# EAGLE design Maze Schematic (EAGLE 9.0.0)
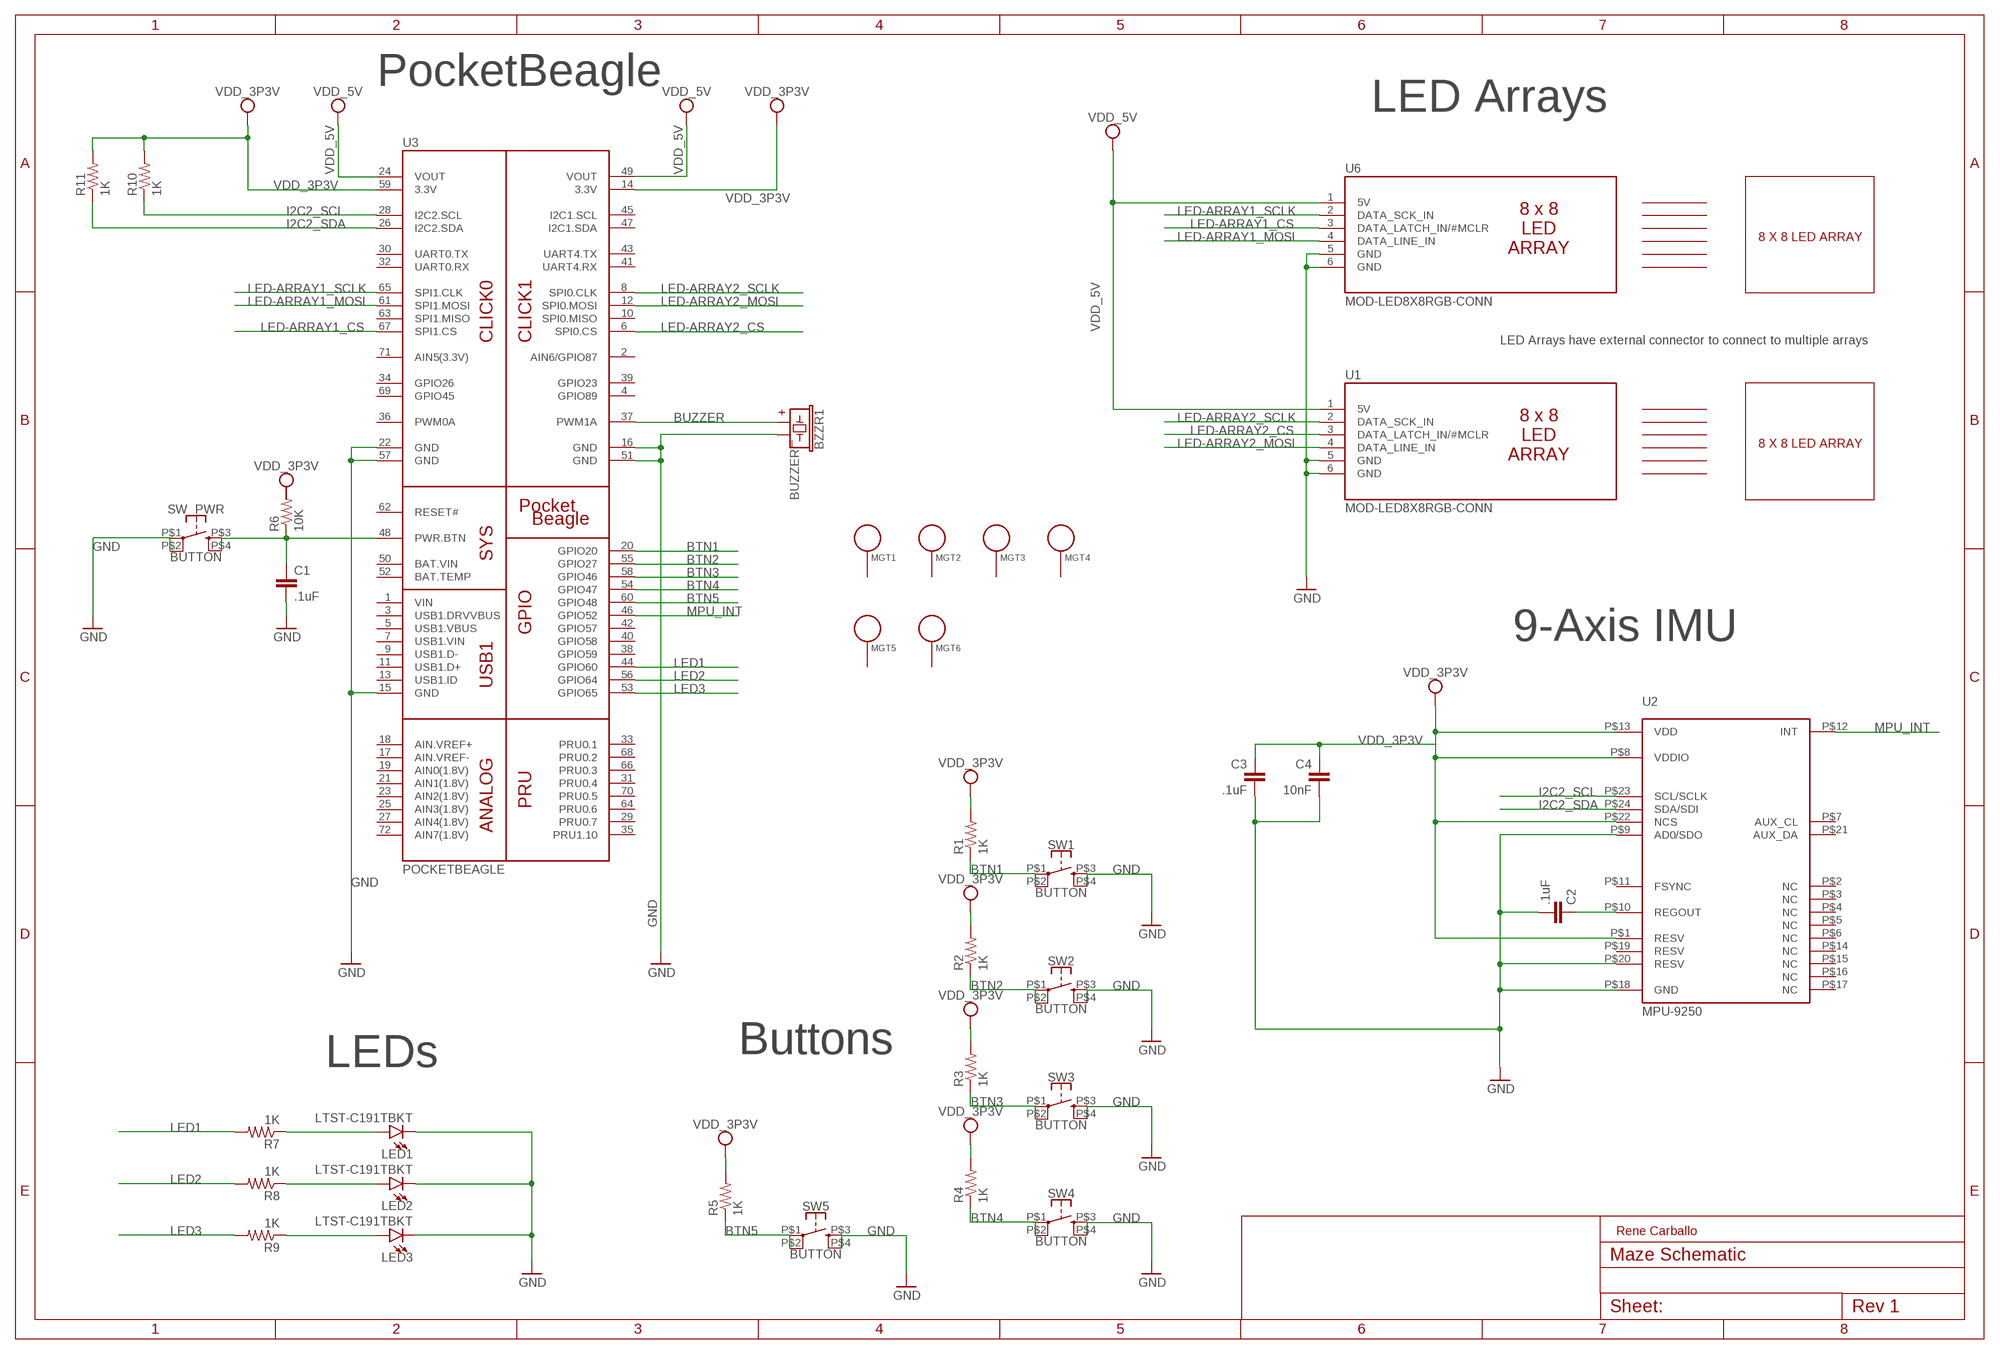
[diagram p0: schematic, sheet 1]

## Parts
BZZR1  BUZZER  [BUZZER-12MM]
C1  .1uF  C_C0603  [C0603]
C2  .1uF  C_C0603  [C0603]
C3  .1uF  C_C0603  [C0603]
C4  10nF  C_C0603  [C0603]
LED1  LTST-C191TBKT  [LED-SMD]
LED2  LTST-C191TBKT  [LED-SMD]
LED3  LTST-C191TBKT  [LED-SMD]
MGT1  MOUNTING_HOLE  [MOUNTING_HOLE]
MGT2  MOUNTING_HOLE  [MOUNTING_HOLE]
MGT3  MOUNTING_HOLE  [MOUNTING_HOLE]
MGT4  MOUNTING_HOLE  [MOUNTING_HOLE]
MGT5  MOUNTING_HOLE  [MOUNTING_HOLE]
MGT6  MOUNTING_HOLE  [MOUNTING_HOLE]
R1  1K  R_R0603  [R0603]
R2  1K  R_R0603  [R0603]
R3  1K  R_R0603  [R0603]
R4  1K  R_R0603  [R0603]
R5  1K  R_R0603  [R0603]
R6  10K  R_R0603  [R0603]
R7  1K  R_R0603  [R0603]
R8  1K  R_R0603  [R0603]
R9  1K  R_R0603  [R0603]
R10  1K  R_R0603  [R0603]
R11  1K  R_R0603  [R0603]
SW1  BUTTON  [BUTTON-11.5X11.7MM]
SW2  BUTTON  [BUTTON-11.5X11.7MM]
SW3  BUTTON  [BUTTON-11.5X11.7MM]
SW4  BUTTON  [BUTTON-11.5X11.7MM]
SW5  BUTTON  [BUTTON-11.5X11.7MM]
SW_PWR  BUTTON  [BUTTON-11.5X11.7MM]
U1  MOD-LED8X8RGB-CONN  [FE06W]
U2  MPU-9250  [QFN-3X3MM]
U3  POCKETBEAGLE  [POCKETBEAGLE]
U6  MOD-LED8X8RGB-CONN  [FE06W]

## Nets
BTN1: R1.1 SW1.P$1 SW1.P$2 U3.20(GPIO20)
BTN2: R2.1 SW2.P$1 SW2.P$2 U3.55(GPIO27)
BTN3: R3.1 SW3.P$1 SW3.P$2 U3.58(GPIO46)
BTN4: R4.1 SW4.P$1 SW4.P$2 U3.54(GPIO47)
BTN5: R5.1 SW5.P$1 SW5.P$2 U3.60(GPIO48)
BUZZER: BZZR1.+ U3.37(PWM1A)
GND: BZZR1.- C1.2 C2.2 C3.2 C4.2 LED1.C(-) LED2.C(-) LED3.C(-) SW1.P$3 SW1.P$4 SW2.P$3 SW2.P$4 SW3.P$3 SW3.P$4 SW4.P$3 SW4.P$4 SW5.P$3 SW5.P$4 SW_PWR.P$1 SW_PWR.P$2 U1.5(GND) U1.6(GND) U2.P$9(AD0/SDO) U2.P$18(GND) U2.P$20(RESV) U3.15(GND) U3.16(GND) U3.22(GND) U3.51(GND) U3.57(GND) U6.5(GND) U6.6(GND)
I2C2_SCL: R10.1 U2.P$23(SCL/SCLK) U3.28(I2C2.SCL)
I2C2_SDA: R11.1 U2.P$24(SDA/SDI) U3.26(I2C2.SDA)
LED1: R7.2 U3.44(GPIO60)
LED2: R8.2 U3.56(GPIO64)
LED3: R9.2 U3.53(GPIO65)
LED-ARRAY1_CS: U3.67(SPI1.CS) U6.3(DATA_LATCH_IN/#MCLR)
LED-ARRAY1_MOSI: U3.61(SPI1.MOSI) U6.4(DATA_LINE_IN)
LED-ARRAY1_SCLK: U3.65(SPI1.CLK) U6.2(DATA_SCK_IN)
LED-ARRAY2_CS: U1.3(DATA_LATCH_IN/#MCLR) U3.6(SPI0.CS)
LED-ARRAY2_MOSI: U1.4(DATA_LINE_IN) U3.12(SPI0.MOSI)
LED-ARRAY2_SCLK: U1.2(DATA_SCK_IN) U3.8(SPI0.CLK)
MPU_INT: U2.P$12(INT) U3.46(GPIO52)
N$4: C1.1 R6.1 SW_PWR.P$3 SW_PWR.P$4 U3.48(PWR.BTN)
N$5: LED1.A(+) R7.1
N$6: LED2.A(+) R8.1
N$7: LED3.A(+) R9.1
REGOUT: C2.1 U2.P$10(REGOUT)
VDD_3P3V: C3.1 C4.1 R1.2 R2.2 R3.2 R4.2 R5.2 R10.2 R11.2 U2.P$1(RESV) U2.P$8(VDDIO) U2.P$13(VDD) U2.P$22(NCS) U3.14(3.3V) U3.59(3.3V)
VDD_5V: U1.1(5V) U3.24(VOUT) U3.49(VOUT) U6.1(5V)
Unconnected: MGT1.P$1 MGT2.P$1 MGT3.P$1 MGT4.P$1 MGT5.P$1 MGT6.P$1 R6.2 U2.P$2(NC) U2.P$3(NC) U2.P$4(NC) U2.P$5(NC) U2.P$6(NC) U2.P$7(AUX_CL) U2.P$11(FSYNC) U2.P$14(NC) U2.P$15(NC) U2.P$16(NC) U2.P$17(NC) U2.P$19(RESV) U2.P$21(AUX_DA) U3.1(VIN) U3.2(AIN6/GPIO87) U3.3(USB1.DRVVBUS) U3.4(GPIO89) U3.5(USB1.VBUS) U3.7(USB1.VIN) U3.9(USB1.D-) U3.10(SPI0.MISO) U3.11(USB1.D+) U3.13(USB1.ID) U3.17(AIN.VREF-) U3.18(AIN.VREF+) U3.19(AIN0(1.8V)) U3.21(AIN1(1.8V)) U3.23(AIN2(1.8V)) U3.25(AIN3(1.8V)) U3.27(AIN4(1.8V)) U3.29(PRU0.7) U3.30(UART0.TX) U3.31(PRU0.4) U3.32(UART0.RX) U3.33(PRU0.1) U3.34(GPIO26) U3.35(PRU1.10) U3.36(PWM0A) U3.38(GPIO59) U3.39(GPIO23) U3.40(GPIO58) U3.41(UART4.RX) U3.42(GPIO57) U3.43(UART4.TX) U3.45(I2C1.SCL) U3.47(I2C1.SDA) U3.50(BAT.VIN) U3.52(BAT.TEMP) U3.62(RESET#) U3.63(SPI1.MISO) U3.64(PRU0.6) U3.66(PRU0.3) U3.68(PRU0.2) U3.69(GPIO45) U3.70(PRU0.5) U3.71(AIN5(3.3V)) U3.72(AIN7(1.8V))

## Notes on the sheet
- PocketBeagle
- LED Arrays
- 8 X 8 LED ARRAY
- LED Arrays have external connector to connect to multiple arrays
- 8 X 8 LED ARRAY
- 9-Axis IMU
- LEDs | Buttons
- Rene Carballo

## Library data of the parts
BZZR1 = Buzzer Box:BUZZER
C1-C4 = Buzzer Box:C_: Capacitor SMD. Sizes: 0402, 0603 & 0805
LED1-LED3 = Buzzer Box:LTST-C191TBKT
MGT1-MGT6 = Buzzer Box:MOUNTING_HOLE: Chassis Mounting Hole w/GND connection ability
R1-R11 = Buzzer Box:R_: RESISTOR, American symbol
SW1-SW5 SW_PWR = Buzzer Box:BUTTON
U1 U6 = Buzzer Box:MOD-LED8X8RGB-CONN
U2 = Buzzer Box:MPU-9250
U3 = Buzzer Box:POCKETBEAGLE

## Board
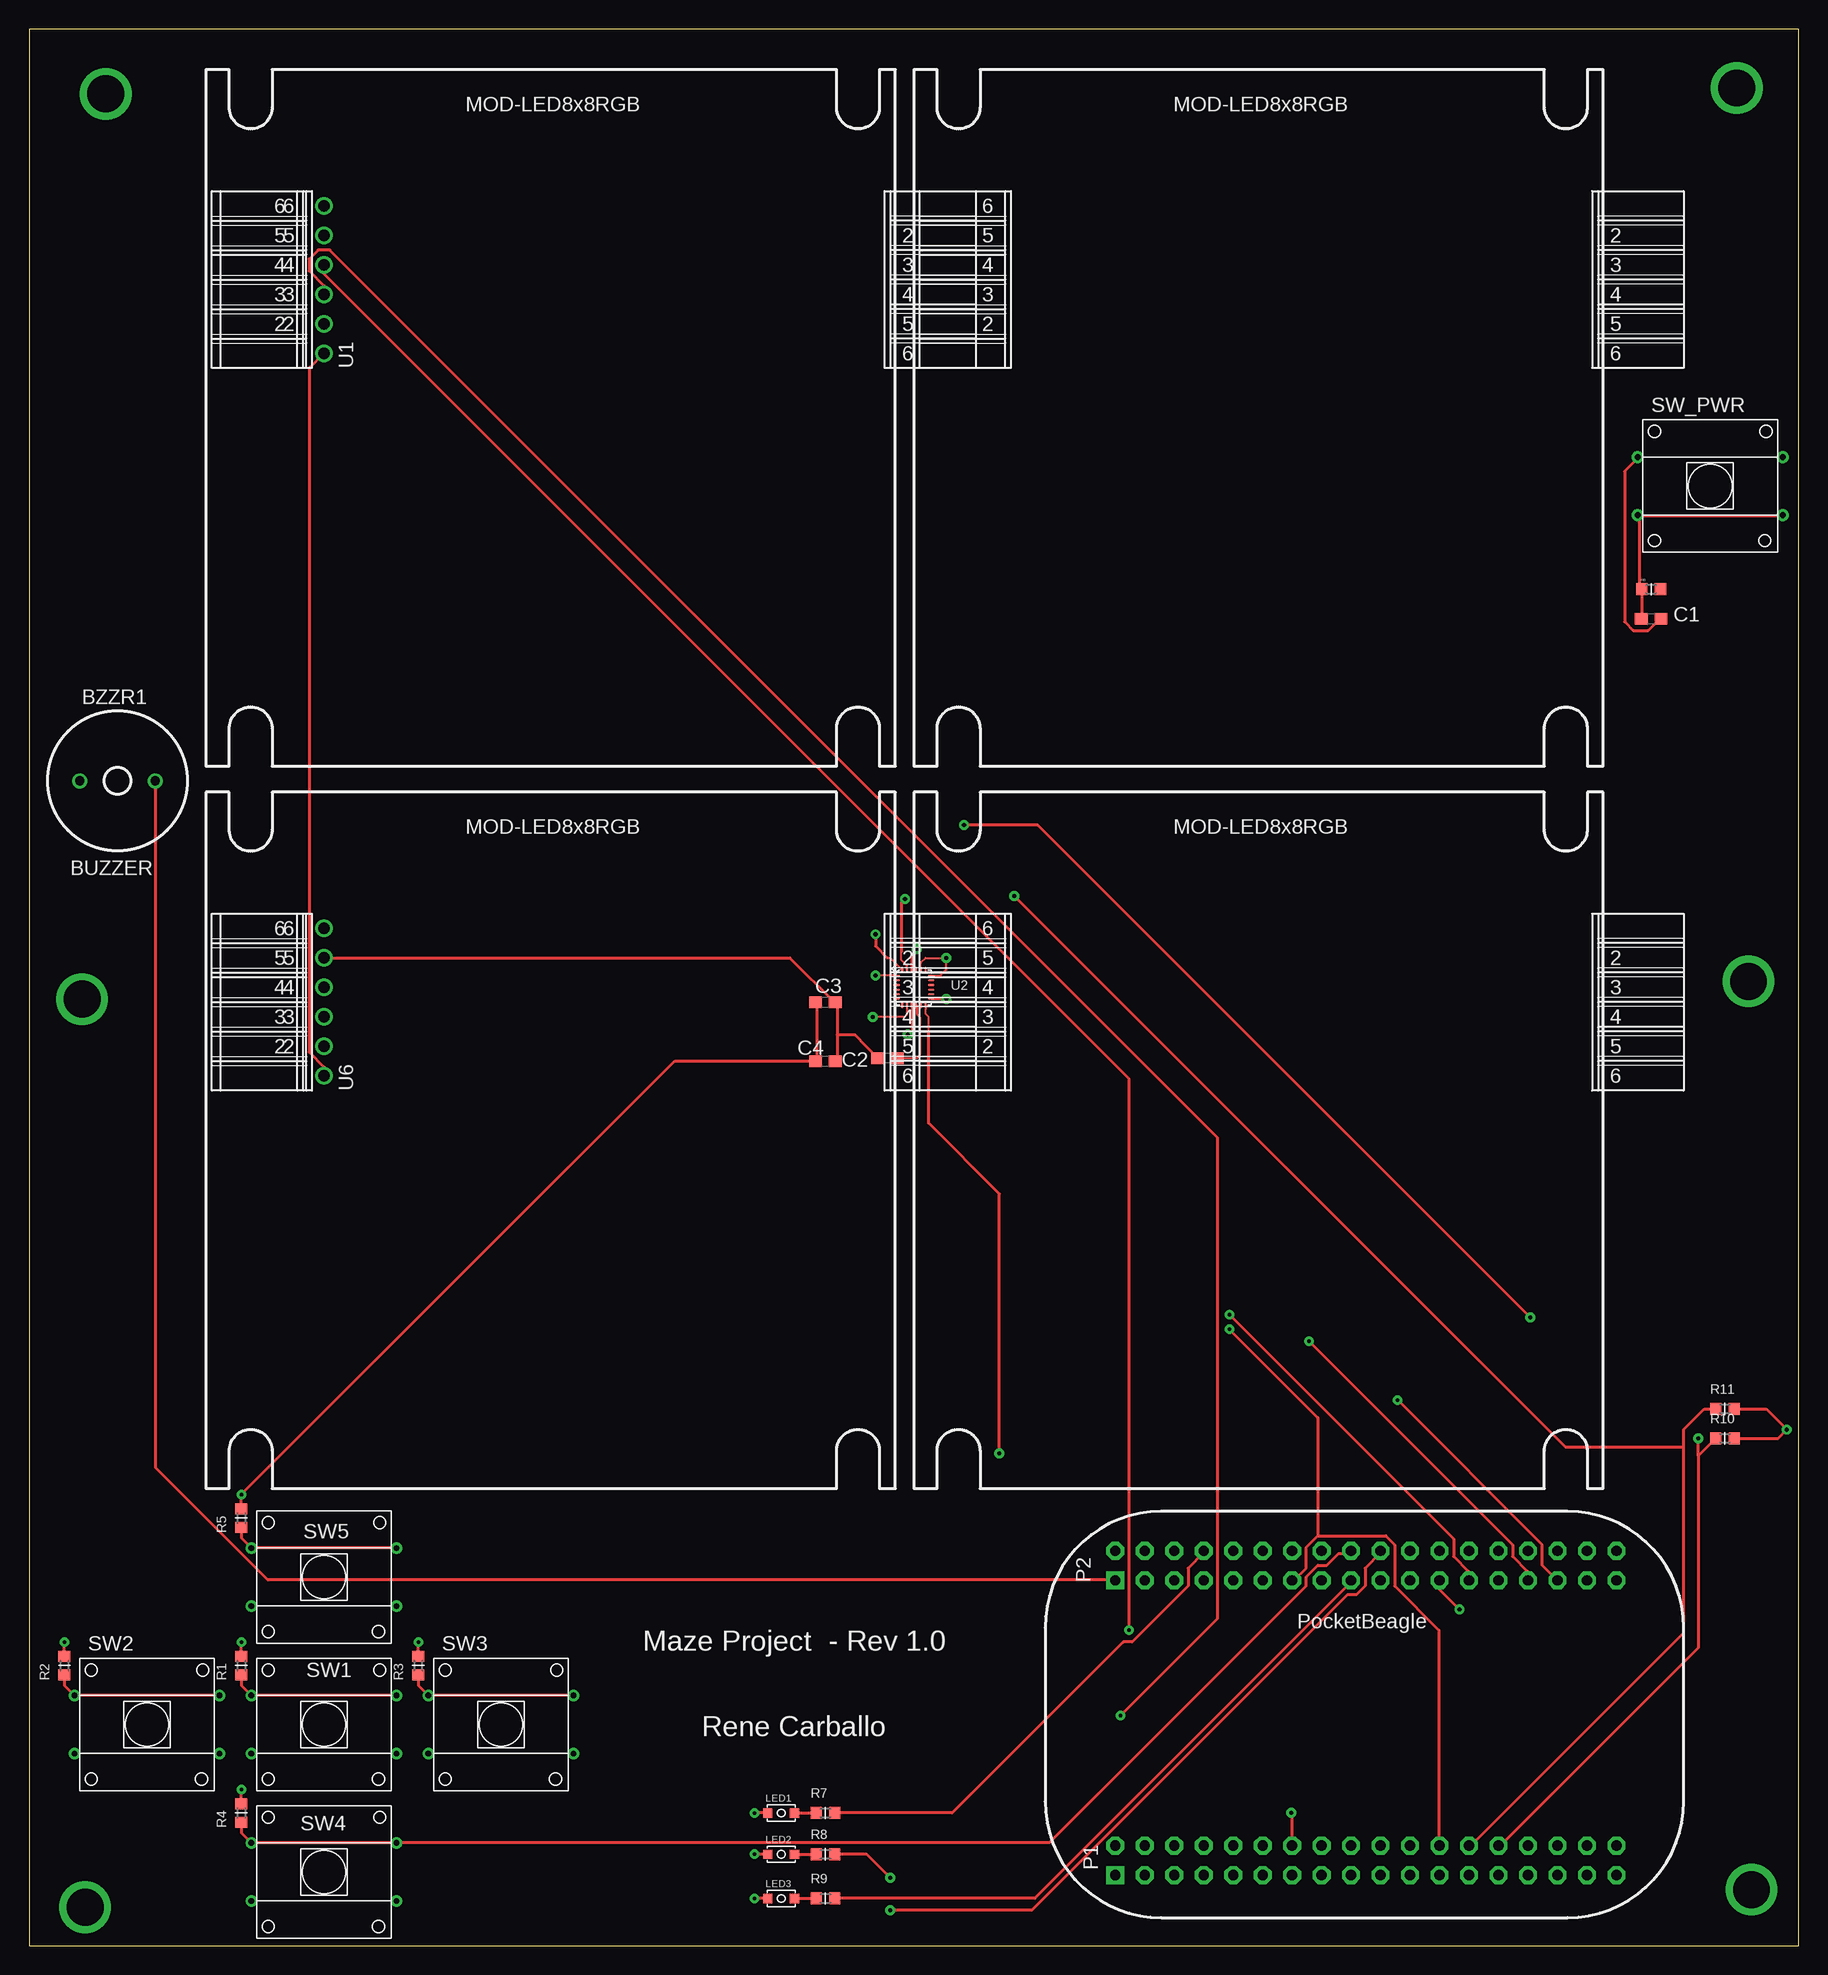
[diagram p1: board, top side]
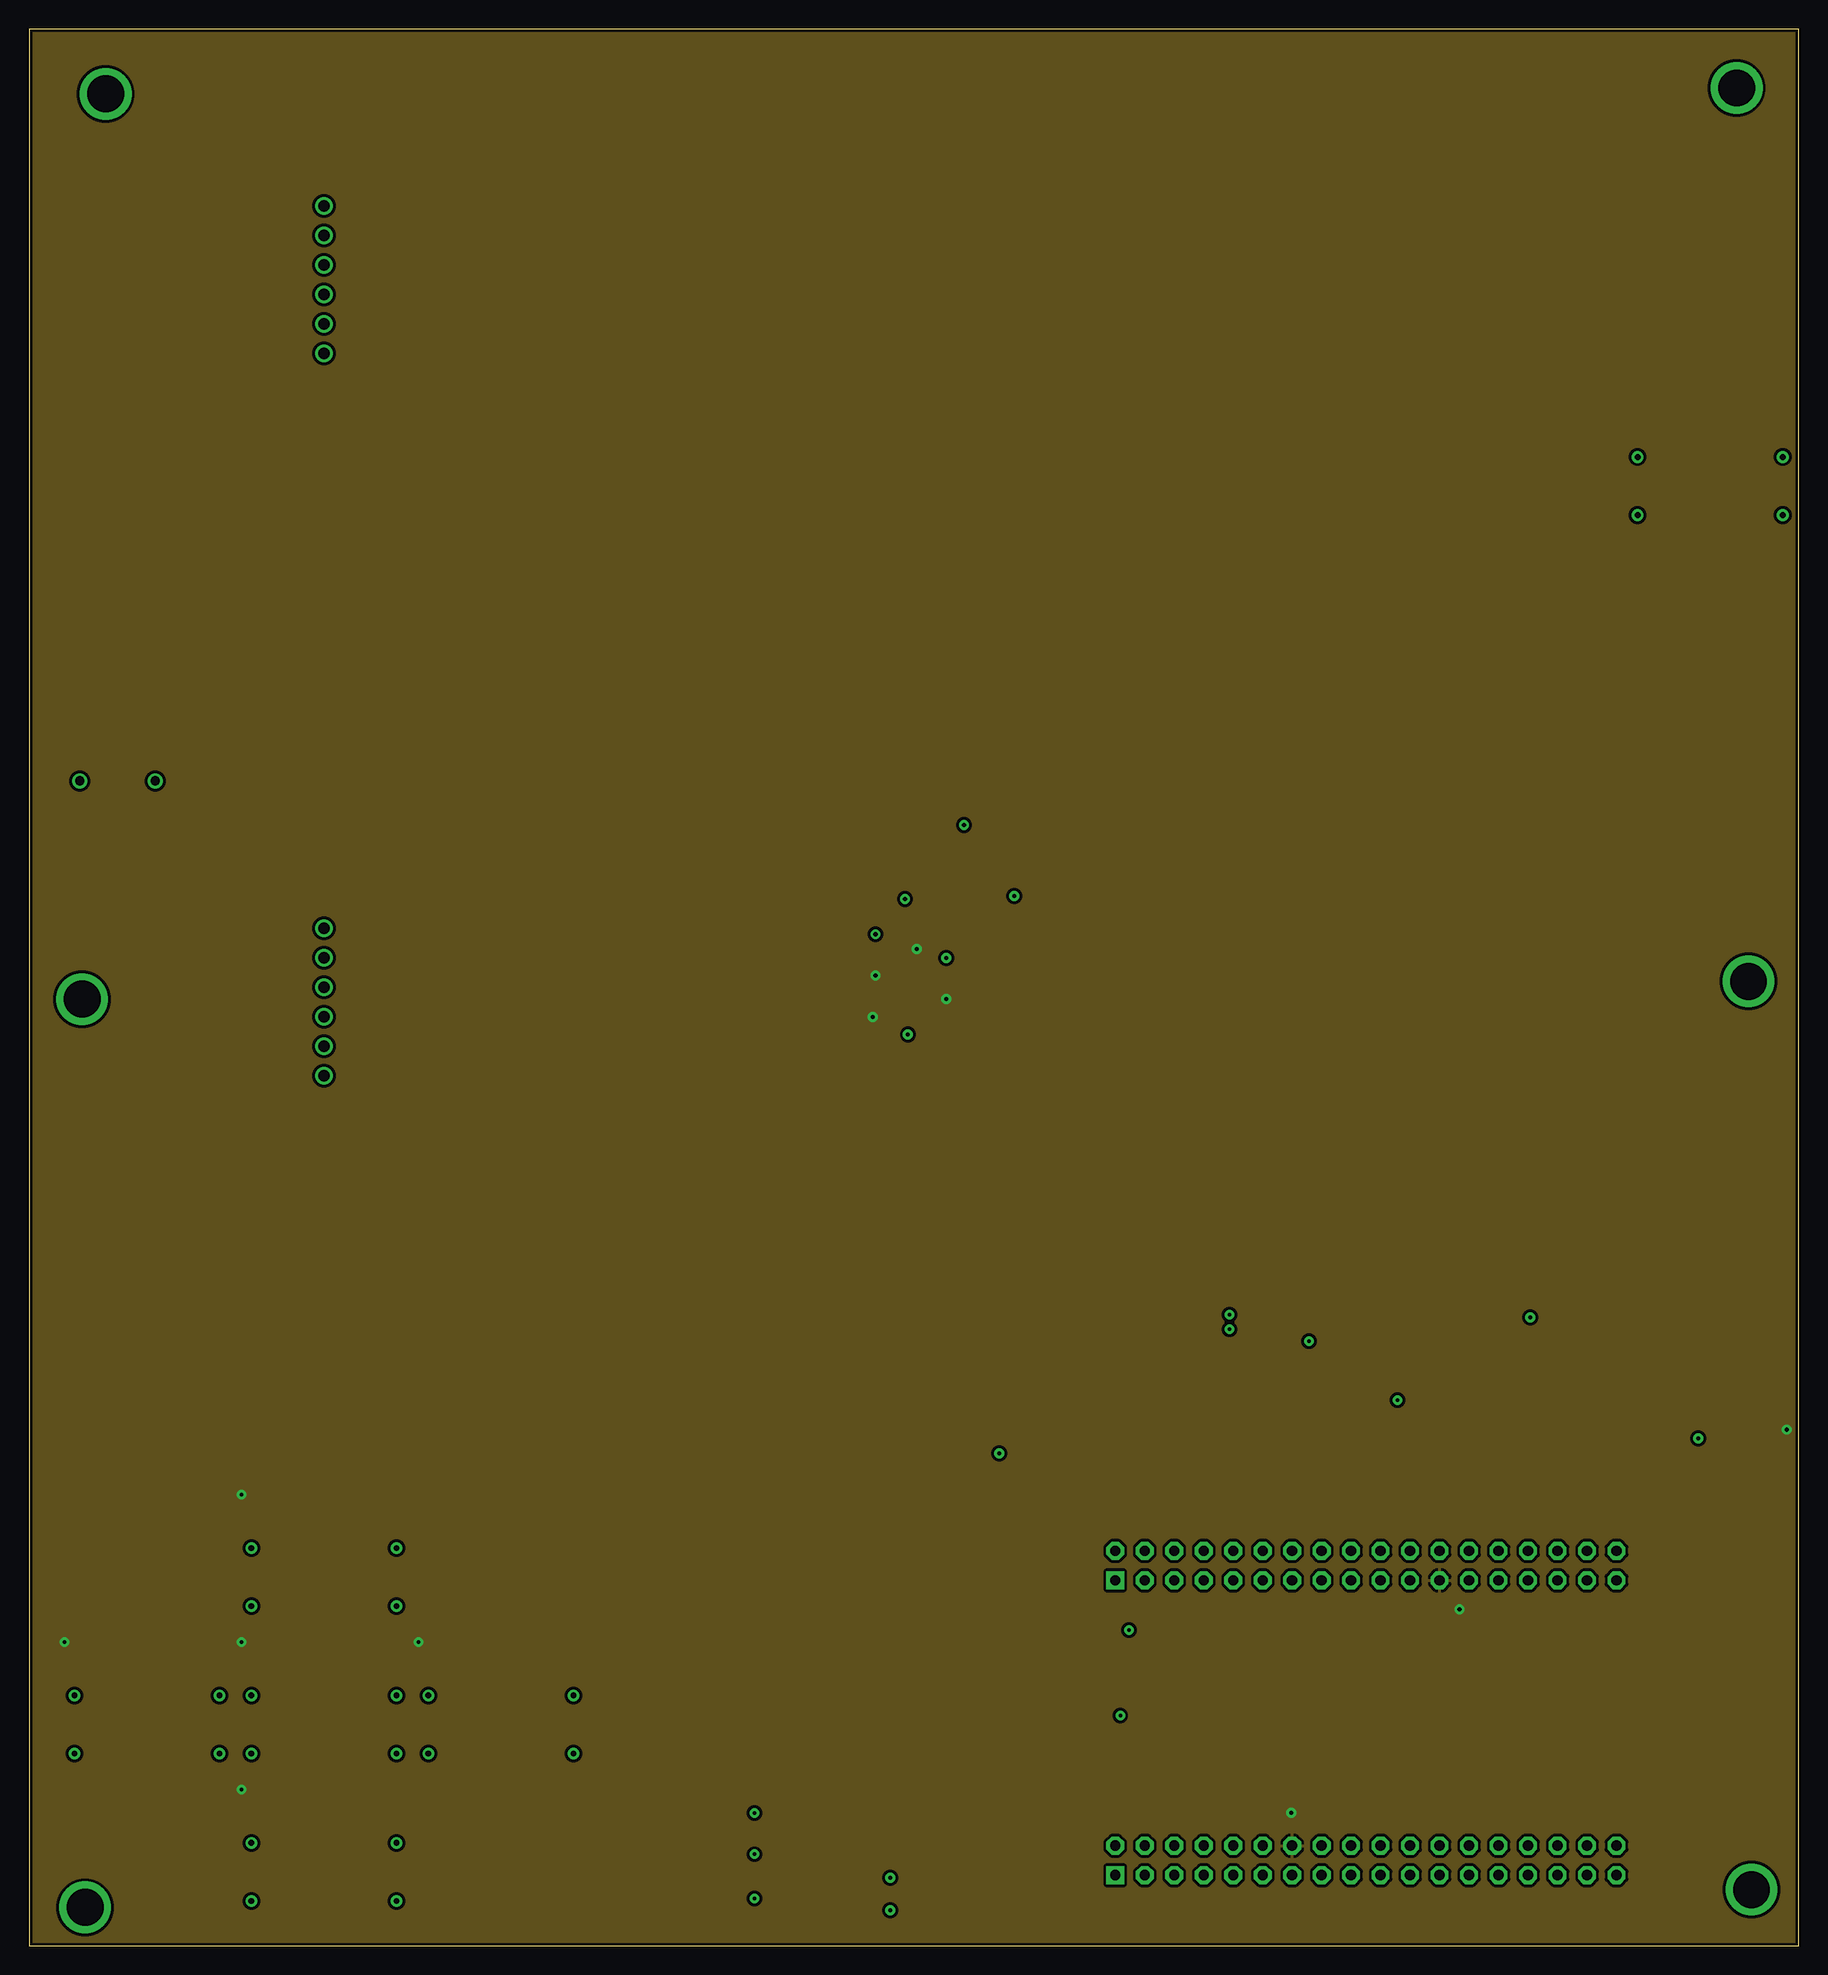
[diagram p2: board, inner layer Route2]
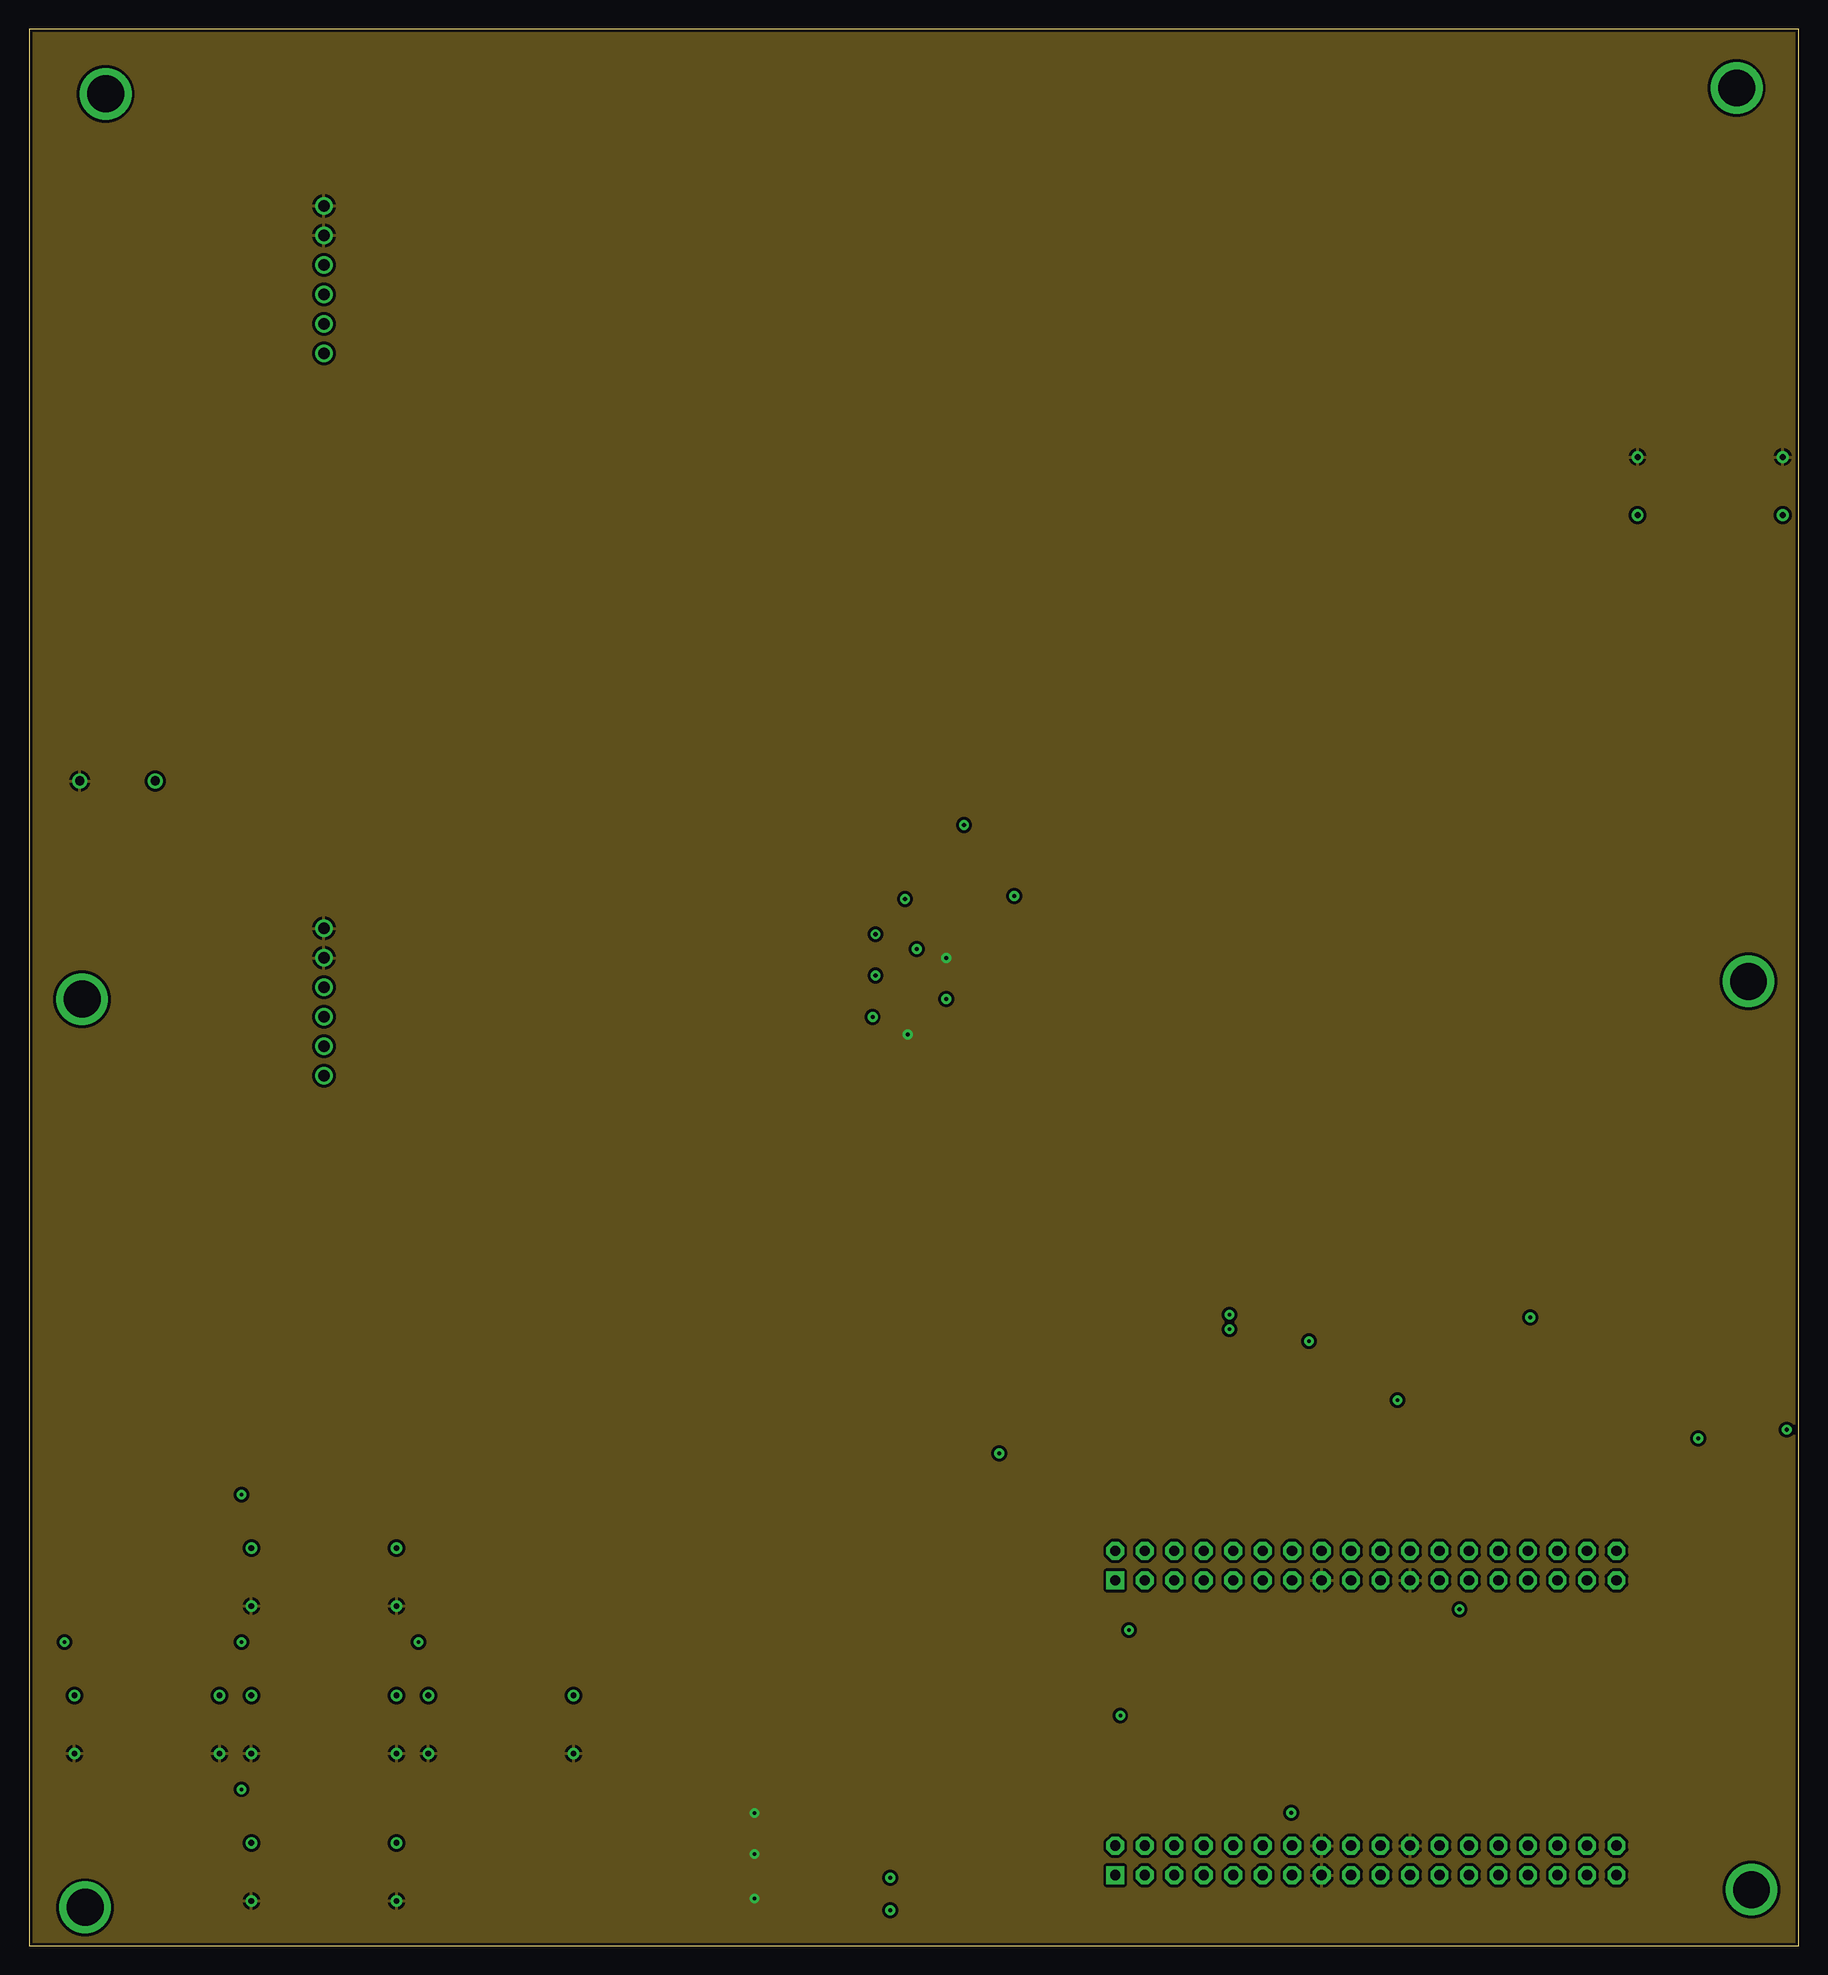
[diagram p3: board, inner layer Route15]
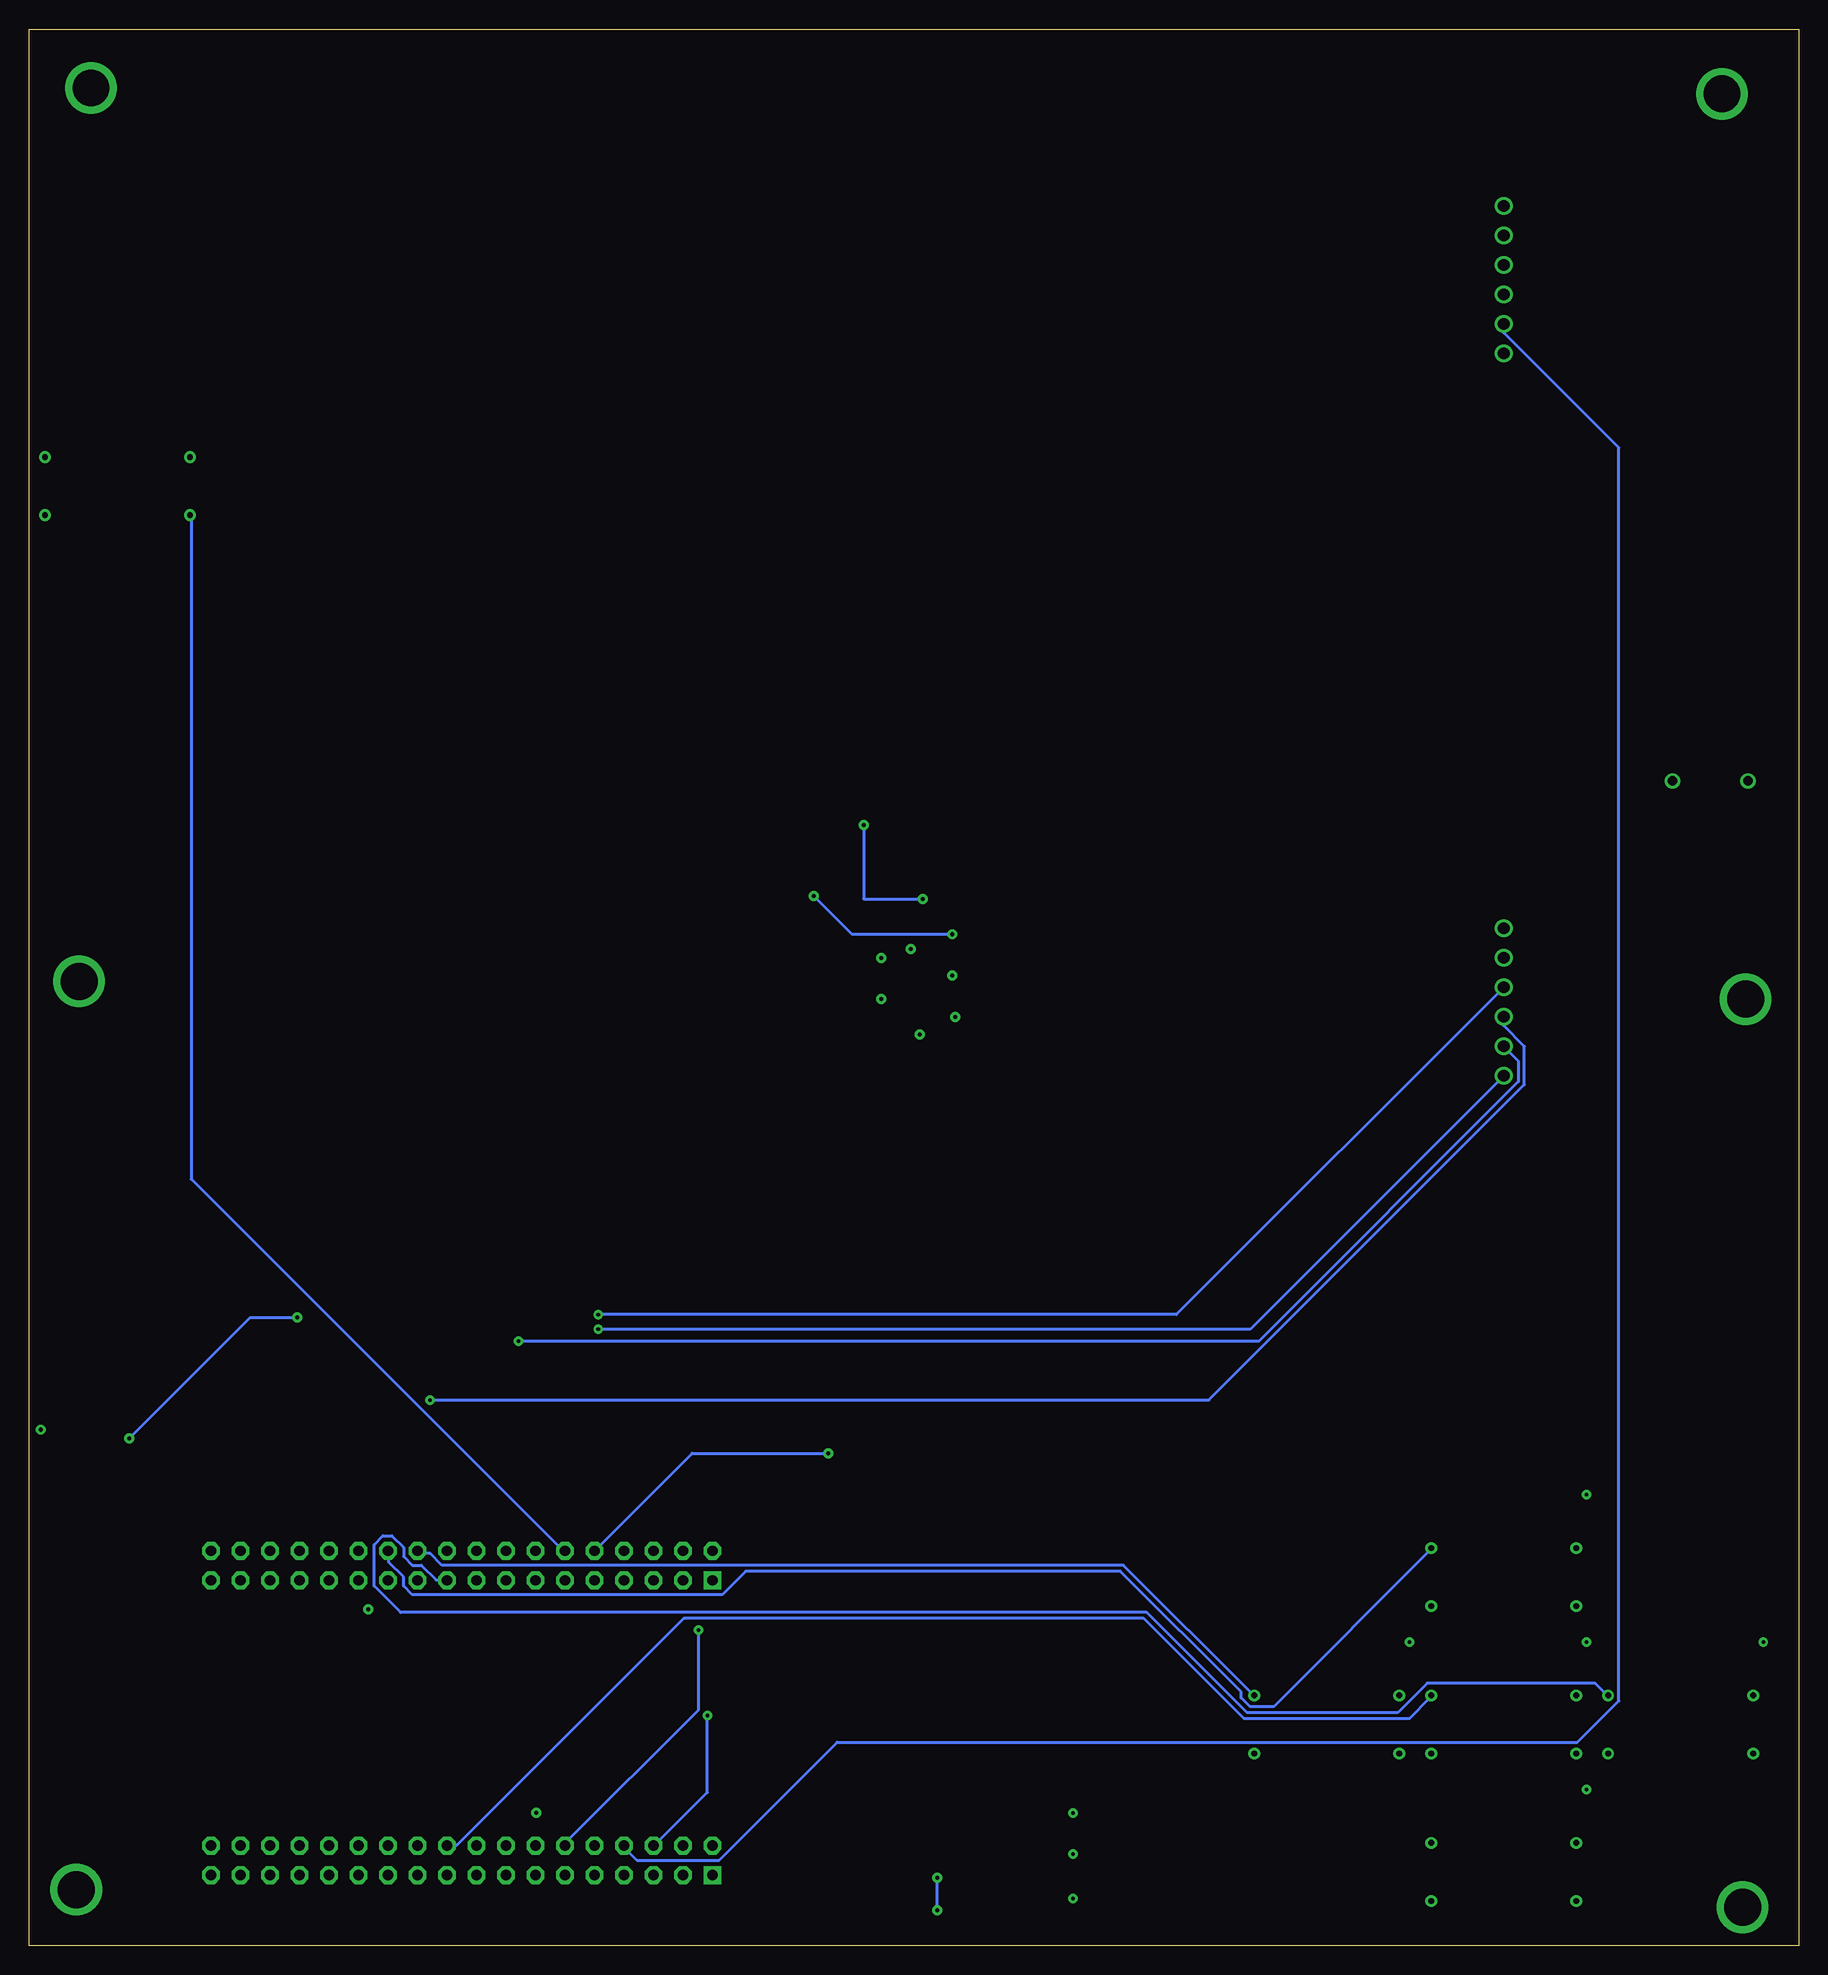
[diagram p4: board, bottom side, seen from below]

Size 152.4 x 165.1 mm. Coordinates in mm from the lower left corner, seen from the top.
Outline: 0,0 152.4,0 152.4,165.1 0,165.1 0,0
Copper layers (1*2*15*16): Top 0.035mm / dielectric 0.23mm / Route2 0.035mm / dielectric 0.93mm / Route15 0.035mm / dielectric 0.23mm / Bottom 0.035mm
Design rules "ENGI301_Maze_Project_4lyr": minimum track width 10mil, minimum drill 12mil, track to track 10mil, track to pad 10mil, pad to pad 10mil, via to via 10mil, smd to smd 10mil, copper to edge 10mil, drill to drill 12mil, minimum pad ring 10mil, minimum via ring 10mil, stop-mask expansion 3mil, vias tented up to drill 25mil, thermal gap 10mil

### Footprints (pad centres in the part's own frame; a part is rotated, then mirrored left to right if it is on the bottom)
BUZZER-12MM = drill 0.8: + 0,-3.25; - 0,3.25
C0603 = smd 1.1 x 1: 1 -0.85,0; 2 0.85,0
LED-SMD = smd 0.8 x 0.8: A(+) 1.15,0; C(-) -1.15,0
MOUNTING_HOLE = drill 3.175 pad 4.445: P$1 0,0
R0603 = smd 0.95 x 1.031: 1 -0.8,0; 2 0.8,0
BUTTON-11.5X11.7MM = drill 0.5: P$1 -6.25,2.5; P$2 6.25,2.5; P$3 -6.25,-2.5; P$4 6.25,-2.5
FE06W = drill 1.016: 1 -6.35,0; 2 -3.81,0; 3 -1.27,0; 4 1.27,0; 5 3.81,0; 6 6.35,0
QFN-3X3MM = smd 0.6 x 0.2: P$1 -1.5,1; P$2 -1.5,0.6; P$3 -1.5,0.2; P$4 -1.5,-0.2; P$5 -1.5,-0.6; P$6 -1.5,-1; P$13 1.5,-1; P$14 1.5,-0.6; P$15 1.5,-0.2; P$16 1.5,0.2; P$17 1.5,0.6; P$18 1.5,1 | smd 0.2 x 0.6: P$7 -1,-1.5; P$8 -0.6,-1.5; P$9 -0.2,-1.5; P$10 0.2,-1.5; P$11 0.6,-1.5; P$12 1,-1.5; P$19 1,1.5; P$20 0.6,1.5; P$21 0.2,1.5; P$22 -0.2,1.5; P$23 -0.6,1.5; P$24 -1,1.5
POCKETBEAGLE = drill 0.889 pad 1.524 square: 1 5.91,3.53; 37 5.91,28.93 | drill 0.889 pad 1.524 octagon: 2 5.91,6.07; 3 8.45,3.53; 4 8.45,6.07; 5 10.99,3.53; 6 10.99,6.07; 7 13.53,3.53; 8 13.53,6.07; 9 16.07,3.53; 10 16.07,6.07; 11 18.61,3.53; 12 18.61,6.07; 13 21.15,3.53; 14 21.15,6.07; 15 23.69,3.53; 16 23.69,6.07; 17 26.23,3.53; 18 26.23,6.07; 19 28.77,3.53; 20 28.77,6.07; 21 31.31,3.53; 22 31.31,6.07; 23 33.85,3.53; 24 33.85,6.07; 25 36.39,3.53; 26 36.39,6.07; 27 38.93,3.53; 28 38.93,6.07; 29 41.47,3.53; 30 41.47,6.07; 31 44.01,3.53; 32 44.01,6.07; 33 46.55,3.53; 34 46.55,6.07; 35 49.09,3.53; 36 49.09,6.07; 38 5.91,31.47; 39 8.45,28.93; 40 8.45,31.47; 41 10.99,28.93; 42 10.99,31.47; 43 13.53,28.93; 44 13.53,31.47; 45 16.07,28.93; 46 16.07,31.47; 47 18.61,28.93; 48 18.61,31.47; 49 21.15,28.93; 50 21.15,31.47; 51 23.69,28.93; 52 23.69,31.47; 53 26.23,28.93; 54 26.23,31.47; 55 28.77,28.93; 56 28.77,31.47; 57 31.31,28.93; 58 31.31,31.47; 59 33.85,28.93; 60 33.85,31.47; 61 36.39,28.93; 62 36.39,31.47; 63 38.93,28.93; 64 38.93,31.47; 65 41.47,28.93; 66 41.47,31.47; 67 44.01,28.93; 68 44.01,31.47; 69 46.55,28.93; 70 46.55,31.47; 71 49.09,28.93; 72 49.09,31.47

### Placement (x,y rotation side)
BZZR1  7.62,100.33 90 top
C1  139.7,114.3 0 top
C2  73.91,76.45 180 top
C3  68.58,81.28 0 top
C4  68.58,76.2 0 top
LED1  64.77,11.43 0 top
LED2  64.77,7.87 0 top
LED3  64.77,4.06 0 top
MGT1  6.6,159.51 0 top
MGT2  147.07,160.02 0 top
MGT3  4.57,81.53 0 top
MGT4  148.08,83.06 0 top
MGT5  148.34,4.83 0 top
MGT6  4.83,3.3 0 top
R1  18.29,24.13 90 top
R2  3.05,24.13 90 top
R3  33.53,24.13 90 top
R4  18.29,11.43 90 top
R5  18.29,36.83 90 top
R6  139.7,116.84 0 top
R7  68.58,11.43 0 top
R8  68.58,7.87 0 top
R9  68.58,4.06 0 top
R10  146.05,43.69 0 top
R11  146.05,46.23 0 top
SW1  25.4,19.05 0 top
SW2  10.16,19.05 0 top
SW3  40.64,19.05 0 top
SW4  25.4,6.35 0 top
SW5  25.4,31.75 0 top
SW_PWR  144.78,125.73 0 top
U1  25.4,143.51 90 top
U2  76.2,82.55 0 top
U3  87.63,2.54 0 top
U6  25.4,81.28 90 top
U$1  [MOD-LED8X8RGB]  76.2,101.6 0 top
U$4  [MOD-LED8X8RGB]  15.24,101.6 0 top
U$5  [MOD-LED8X8RGB]  15.24,39.37 0 top
U$6  [MOD-LED8X8RGB]  76.2,39.37 0 top

### Tracks (layer width: path | path; a pad name or v marks a point on that pad's centre or on a via)
BTN1
  Top 0.254: R1.1 18.29,22.41 SW1.P$1 19.3,21.59 31.5,21.59 SW1.P$2
  Bottom 0.254: U3.20 116.33,8.64 115.57,8.64 96.01,28.19 56.39,28.19 47.75,19.56 33.53,19.56 31.75,21.34 SW1.P$2
BTN2
  Top 0.254: R2.1 3.05,22.41 SW2.P$1 4.06,21.59 16.26,21.59 SW2.P$2
  Bottom 0.254: U3.55 116.59,31.5 117.35,31.5 118.62,32.77 119.38,32.77 120.14,33.53 120.14,34.29 121.16,35.31 121.92,35.31 122.68,34.54 122.68,30.99 120.4,28.7 56.13,28.7 47.5,20.07 34.54,20.07 32,22.61 17.53,22.61 16.51,21.59 SW2.P$2
BTN3
  Top 0.254: R3.1 33.53,22.41 SW3.P$1 34.54,21.59 46.74,21.59 SW3.P$2
  Bottom 0.254: U3.58 118.87,33.78 117.86,33.78 116.84,32.77 58.17,32.77 46.99,21.59 SW3.P$2
BTN4
  Top 0.254: R4.1 18.29,9.71 SW4.P$1 19.3,8.89 31.5,8.89 SW4.P$2 31.75,8.89 87.88,8.89 109.98,30.99 109.98,31.75 111,32.77 111.76,32.77 112.78,33.78 113.79,33.78 U3.54
BTN5
  Top 0.254: R5.1 18.29,35.11 SW5.P$1 19.3,34.29 31.5,34.29 SW5.P$2
  Bottom 0.254: U3.60 121.41,33.78 121.41,33.02 120.14,31.75 120.14,30.99 119.38,30.23 92.71,30.23 90.68,32.26 58.42,32.26 48.01,21.84 48.01,21.34 47.24,20.57 45.21,20.57 31.75,34.04 SW5.P$2
BUZZER
  Top 0.254: BZZR1.+ 10.92,100.33 10.92,41.15 20.57,31.5 93.47,31.5 U3.37
GND  (via drill 0.3 pad 0.61, 0.35)
  Top 0.152: U2.P$20 76.8,84.67 77.22,85.09 v78.99,85.09 78.99,84.07 78.49,83.57 77.72,83.57 U2.P$18 | v75.69,78.49 76,78.79 U2.P$9
  Top 0.254: LED3.C(-) v62.48,4.06 | LED2.C(-) v62.48,7.87 | LED1.C(-) v62.48,11.43 | 69.6,78.49 69.6,81.28 C3.2 69.34,81.28 65.53,85.09 U6.5 | 69.6,78.49 69.6,76.2 C4.2 | 69.6,78.49 71.12,78.49 C2.2 | C1.2 140.46,114.3 139.45,113.28 138.18,113.28 137.41,114.05 137.41,127 138.43,128.02 SW_PWR.P$1
  pour Route15: -2.54,-2.54 154.94,-2.54 154.94,167.64 -2.54,167.64
I2C2_SCL  (via drill 0.35)
  Top 0.152: 75.14,85.6 75.14,84.88 75.6,84.42 U2.P$23
  Top 0.254: U3.28 126.75,8.64 143.76,25.65 143.76,42.2 | R10.1 143.76,42.2 | 143.76,42.2 v143.76,43.69 | v129.29,54.1 86.87,96.52 v80.52,96.52 | v75.44,90.17 75.14,89.87 75.14,85.6
  Bottom 0.254: v143.76,43.69 133.35,54.1 v129.29,54.1 | v80.52,96.52 80.52,90.17 v75.44,90.17
I2C2_SDA  (via drill 0.35)
  Top 0.152: 73.91,85.09 74.16,85.09 75.17,84.08 | 75.17,84.08 75.17,84.05 | U2.P$24 75.17,84.08
  Top 0.254: U3.26 124.21,8.64 142.49,26.92 142.49,42.93 | 142.49,42.93 142.49,44.45 144.27,46.23 R11.1 | 142.49,42.93 132.33,42.93 v84.84,90.42 | v72.9,87.12 72.9,86.11 73.91,85.09
  Bottom 0.254: v84.84,90.42 81.53,87.12 v72.9,87.12
LED1
  Top 0.254: R7.2 79.5,11.43 94.23,26.16 95,26.16 99.82,30.99 99.82,32.51 101.09,33.78 U3.44
LED2  (via drill 0.35)
  Top 0.254: v74.17,3.05 86.36,3.05 113.54,30.23 114.3,30.23 115.06,30.99 115.06,32.51 116.33,33.78 U3.56 | 69.34,7.87 R8.2 72.14,7.87 v74.17,5.84
  Bottom 0.254: v74.17,3.05 v74.17,5.84
LED3
  Top 0.254: R9.2 86.61,4.06 113.79,31.24 U3.53
LED-ARRAY1_CS  (via drill 0.3)
  Top 0.254: v117.86,46.99 130.3,34.54 130.3,32.77 131.57,31.5 U3.67
  Bottom 0.254: U6.3 25.4,79.25 23.62,77.47 23.62,74.17 50.8,46.99 v117.86,46.99
LED-ARRAY1_MOSI  (via drill 0.3)
  Top 0.254: v103.38,54.36 122.68,35.05 122.68,33.53 123.95,32.26 123.95,31.5 U3.61
  Bottom 0.254: v103.38,54.36 53.59,54.36 U6.4
LED-ARRAY1_SCLK  (via drill 0.3)
  Top 0.254: v110.24,52.07 127.76,34.54 127.76,33.53 129.03,32.26 129.03,31.5 U3.65
  Bottom 0.254: v110.24,52.07 46.48,52.07 24.13,74.42 24.13,76.2 U6.2
LED-ARRAY2_CS  (via drill 0.3)
  Top 0.254: U1.3 25.4,143 24.13,144.27 24.13,145.29 24.89,146.05 25.91,146.05 102.36,69.6 102.36,28.19 v93.98,19.81
  Bottom 0.254: v93.98,19.81 93.98,13.21 98.55,8.64 U3.6
LED-ARRAY2_MOSI  (via drill 0.3)
  Top 0.254: U1.4 25.4,144.02 94.74,74.68 v94.74,27.18
  Bottom 0.254: v94.74,27.18 94.74,20.32 106.43,8.64 U3.12
LED-ARRAY2_SCLK
  Bottom 0.254: U1.2 25.4,138.94 15.49,129.03 15.49,21.08 19.05,17.53 82.8,17.53 92.96,7.37 100.08,7.37 101.09,8.38 U3.8
MPU_INT  (via drill 0.35)
  Top 0.152: 77.47,78.74 77.47,80.01 77.22,80.26 77.22,80.64 77.23,80.66 77.23,81.05 U2.P$12
  Top 0.254: v83.57,42.42 83.57,64.77 77.47,70.87 77.47,78.74
  Bottom 0.254: U3.46 95.29,42.42 v83.57,42.42
N$4
  Top 0.254: C1.1 138.94,114.3 138.94,116.84 R6.1 138.68,116.84 138.68,123.19 | 138.68,123.19 150.88,123.19 SW_PWR.P$4 | 138.68,123.19 SW_PWR.P$3
  Bottom 0.254: U3.48 106.43,34.04 138.43,66.04 138.43,123.19 SW_PWR.P$3
N$5
  Top 0.254: LED1.A(+) R7.1
N$6
  Top 0.254: LED2.A(+) R8.1
N$7
  Top 0.254: LED3.A(+) R9.1
REGOUT
  Top 0.152: C2.1 76.45,76.45 76.71,76.71 76.71,80.01 76.45,80.26 76.45,81 U2.P$10
VDD_3P3V  (via drill 0.3 pad 0.61, 0.35)
  Top 0.152: U2.P$1 73.68,83.55 v72.9,83.57 | U2.P$13 77.72,81.53 v78.99,81.53 | U2.P$22 76,85.29 v76.45,85.85 | U2.P$8 75.6,80.17 75.44,80.01 v72.64,80.01
  Top 0.254: R3.2 v33.53,26.16 | R2.2 v3.05,26.16 | R1.2 v18.29,26.16 | R5.2 v18.29,38.86 55.63,76.2 C4.1 67.82,76.2 67.82,81.28 C3.1 | R4.2 v18.29,13.46 | R11.2 149.61,46.23 v151.38,44.45 150.62,43.69 R10.2 | U3.59 121.48,30.67 v123.19,28.96 | U3.14 108.78,11.36 v108.71,11.43
  pour Route2: -1.27,-1.27 153.67,-1.27 153.67,166.37 -1.27,166.37
VDD_5V  (via drill 0.3)
  Top 0.254: 111,35.31 116.84,35.31 117.6,34.54 117.6,30.99 121.41,27.18 121.41,8.64 U3.24 | 111,35.31 109.98,34.29 109.98,32.51 108.97,31.5 U3.49 | U6.1 25.4,75.69 24.13,76.96 24.13,135.89 U1.1 | 111,35.31 111,45.47 v103.38,53.09
  Bottom 0.254: v103.38,53.09 47.24,53.09 U6.1

### Text on the board
tNames: Maze Project | - Rev 1.0 | Rene Carballo